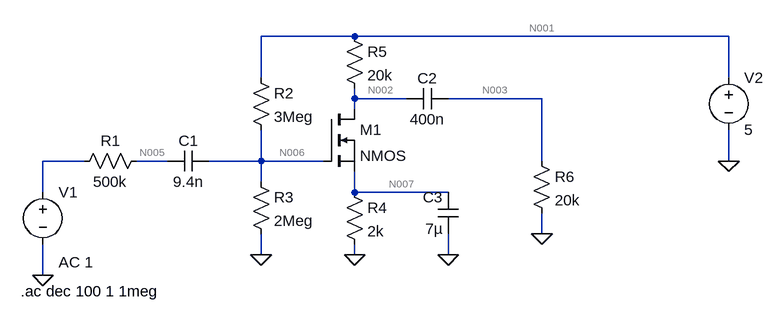
[diagram p0: schematic Draft1.asc]
Draft1.asc, the LTspice schematic file:
Version 4
SHEET 1 904 680
WIRE 272 -32 128 -32
WIRE 848 -32 272 -32
WIRE 128 32 128 -32
WIRE 848 32 848 -32
WIRE 272 64 272 48
WIRE 352 64 272 64
WIRE 560 64 416 64
WIRE 272 80 272 64
WIRE -144 160 -208 160
WIRE -16 160 -64 160
WIRE 128 160 128 112
WIRE 128 160 48 160
WIRE 224 160 128 160
WIRE 560 160 560 64
WIRE 848 160 848 112
WIRE 128 192 128 160
WIRE -208 208 -208 160
WIRE 272 208 272 176
WIRE 416 208 272 208
WIRE 560 272 560 240
WIRE 128 304 128 272
WIRE 272 304 272 288
WIRE 416 304 416 272
WIRE -208 336 -208 288
FLAG -208 336 0
FLAG 560 272 0
FLAG 128 304 0
FLAG 272 304 0
FLAG 416 304 0
FLAG 848 160 0
SYMBOL voltage -208 192 R0
WINDOW 123 24 124 Left 2
WINDOW 39 0 0 Left 0
SYMATTR InstName V1
SYMATTR Value ""
SYMATTR Value2 AC 1
SYMBOL res -48 144 R90
WINDOW 0 0 56 VBottom 2
WINDOW 3 32 56 VTop 2
SYMATTR InstName R1
SYMATTR Value 500k
SYMBOL cap 48 144 R90
WINDOW 0 0 32 VBottom 2
WINDOW 3 32 32 VTop 2
SYMATTR InstName C1
SYMATTR Value 9.4n
SYMBOL res 112 16 R0
SYMATTR InstName R2
SYMATTR Value 3Meg
SYMBOL res 112 176 R0
SYMATTR InstName R3
SYMATTR Value 2Meg
SYMBOL nmos 224 80 R0
SYMATTR InstName M1
SYMBOL res 256 192 R0
SYMATTR InstName R4
SYMATTR Value 2k
SYMBOL res 256 -48 R0
SYMATTR InstName R5
SYMATTR Value 20k
SYMBOL cap 416 48 R90
WINDOW 0 0 32 VBottom 2
WINDOW 3 32 32 VTop 2
SYMATTR InstName C2
SYMATTR Value 400n
SYMBOL cap 432 272 R180
WINDOW 0 24 56 Left 2
WINDOW 3 24 8 Left 2
SYMATTR InstName C3
SYMATTR Value 7µ
SYMBOL res 544 144 R0
SYMATTR InstName R6
SYMATTR Value 20k
SYMBOL voltage 848 16 R0
WINDOW 123 0 0 Left 0
WINDOW 39 0 0 Left 0
SYMATTR InstName V2
SYMATTR Value 5
TEXT -242 360 Left 2 !.ac dec 100 1 1meg

The netlist it stands for:
* Draft1.asc
V1 N004 0 AC 1
R1 N005 N004 500k
C1 N006 N005 9.4n
R2 N001 N006 3Meg
R3 N006 0 2Meg
M1 N002 N006 N007 N007 NMOS
R4 N007 0 2k
R5 N001 N002 20k
C2 N003 N002 400n
C3 0 N007 7µ
R6 N003 0 20k
V2 N001 0 5
.model NMOS NMOS
.model PMOS PMOS
.lib standard.mos
.ac dec 100 1 1meg
.backanno
.end

* Results of the author's LTspice run, read from the files saved beside the schematic
* Operating Point, zero values left out:
*   V(n006) = 2 V
*   V(n001) = 5 V
*   V(n002) = 4.258 V
*   V(n007) = 74.18 mV
*   Id(M1) = 37.09 µA
*   Ib(M1) = -4.194 pA
*   Is(M1) = -37.09 µA
*   I(R5) = 37.09 µA
*   I(R4) = 37.09 µA
*   I(R3) = 1 µA
*   I(R2) = 1 µA
*   I(V2) = -38.09 µA
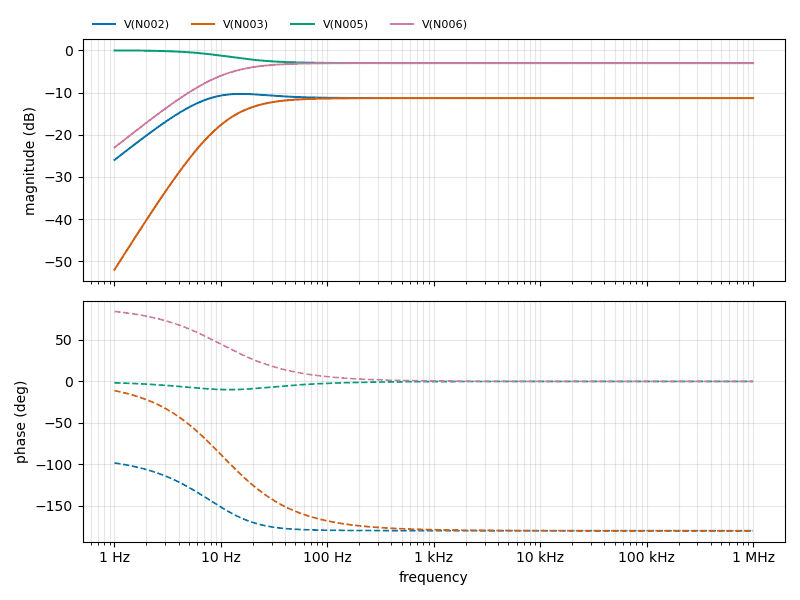
[diagram p1: AC Analysis of Draft1.asc, plotted from the saved traces]
* AC Analysis, 1 run:
*   V(N002): -25.97 dB at 1 Hz, -11.31 dB at 1 MHz, peak -10.32 dB at 15.49 Hz, 3 dB below the peak at 5.16 Hz
*   V(N003): -51.96 dB at 1 Hz, -11.31 dB at 1 MHz, peak -11.31 dB at 1 MHz, 3 dB below the peak at 16.18 Hz
*   V(N005): -0.02 dB at 1 Hz, -3.03 dB at 1 MHz, peak -0.02 dB at 1 Hz
*   V(N006): -23.03 dB at 1 Hz, -3.03 dB at 1 MHz, peak -3.03 dB at 1 MHz, 3 dB below the peak at 9.96 Hz